# EasyEDA schematic SCH_PoC Sensor_Jao.json
TITLE: PoC Sensor; REV: 1.0; Date: 15/12/2023; Sheet: 1/1; Drawn By: Jao Dekeyser; Company: HoGent
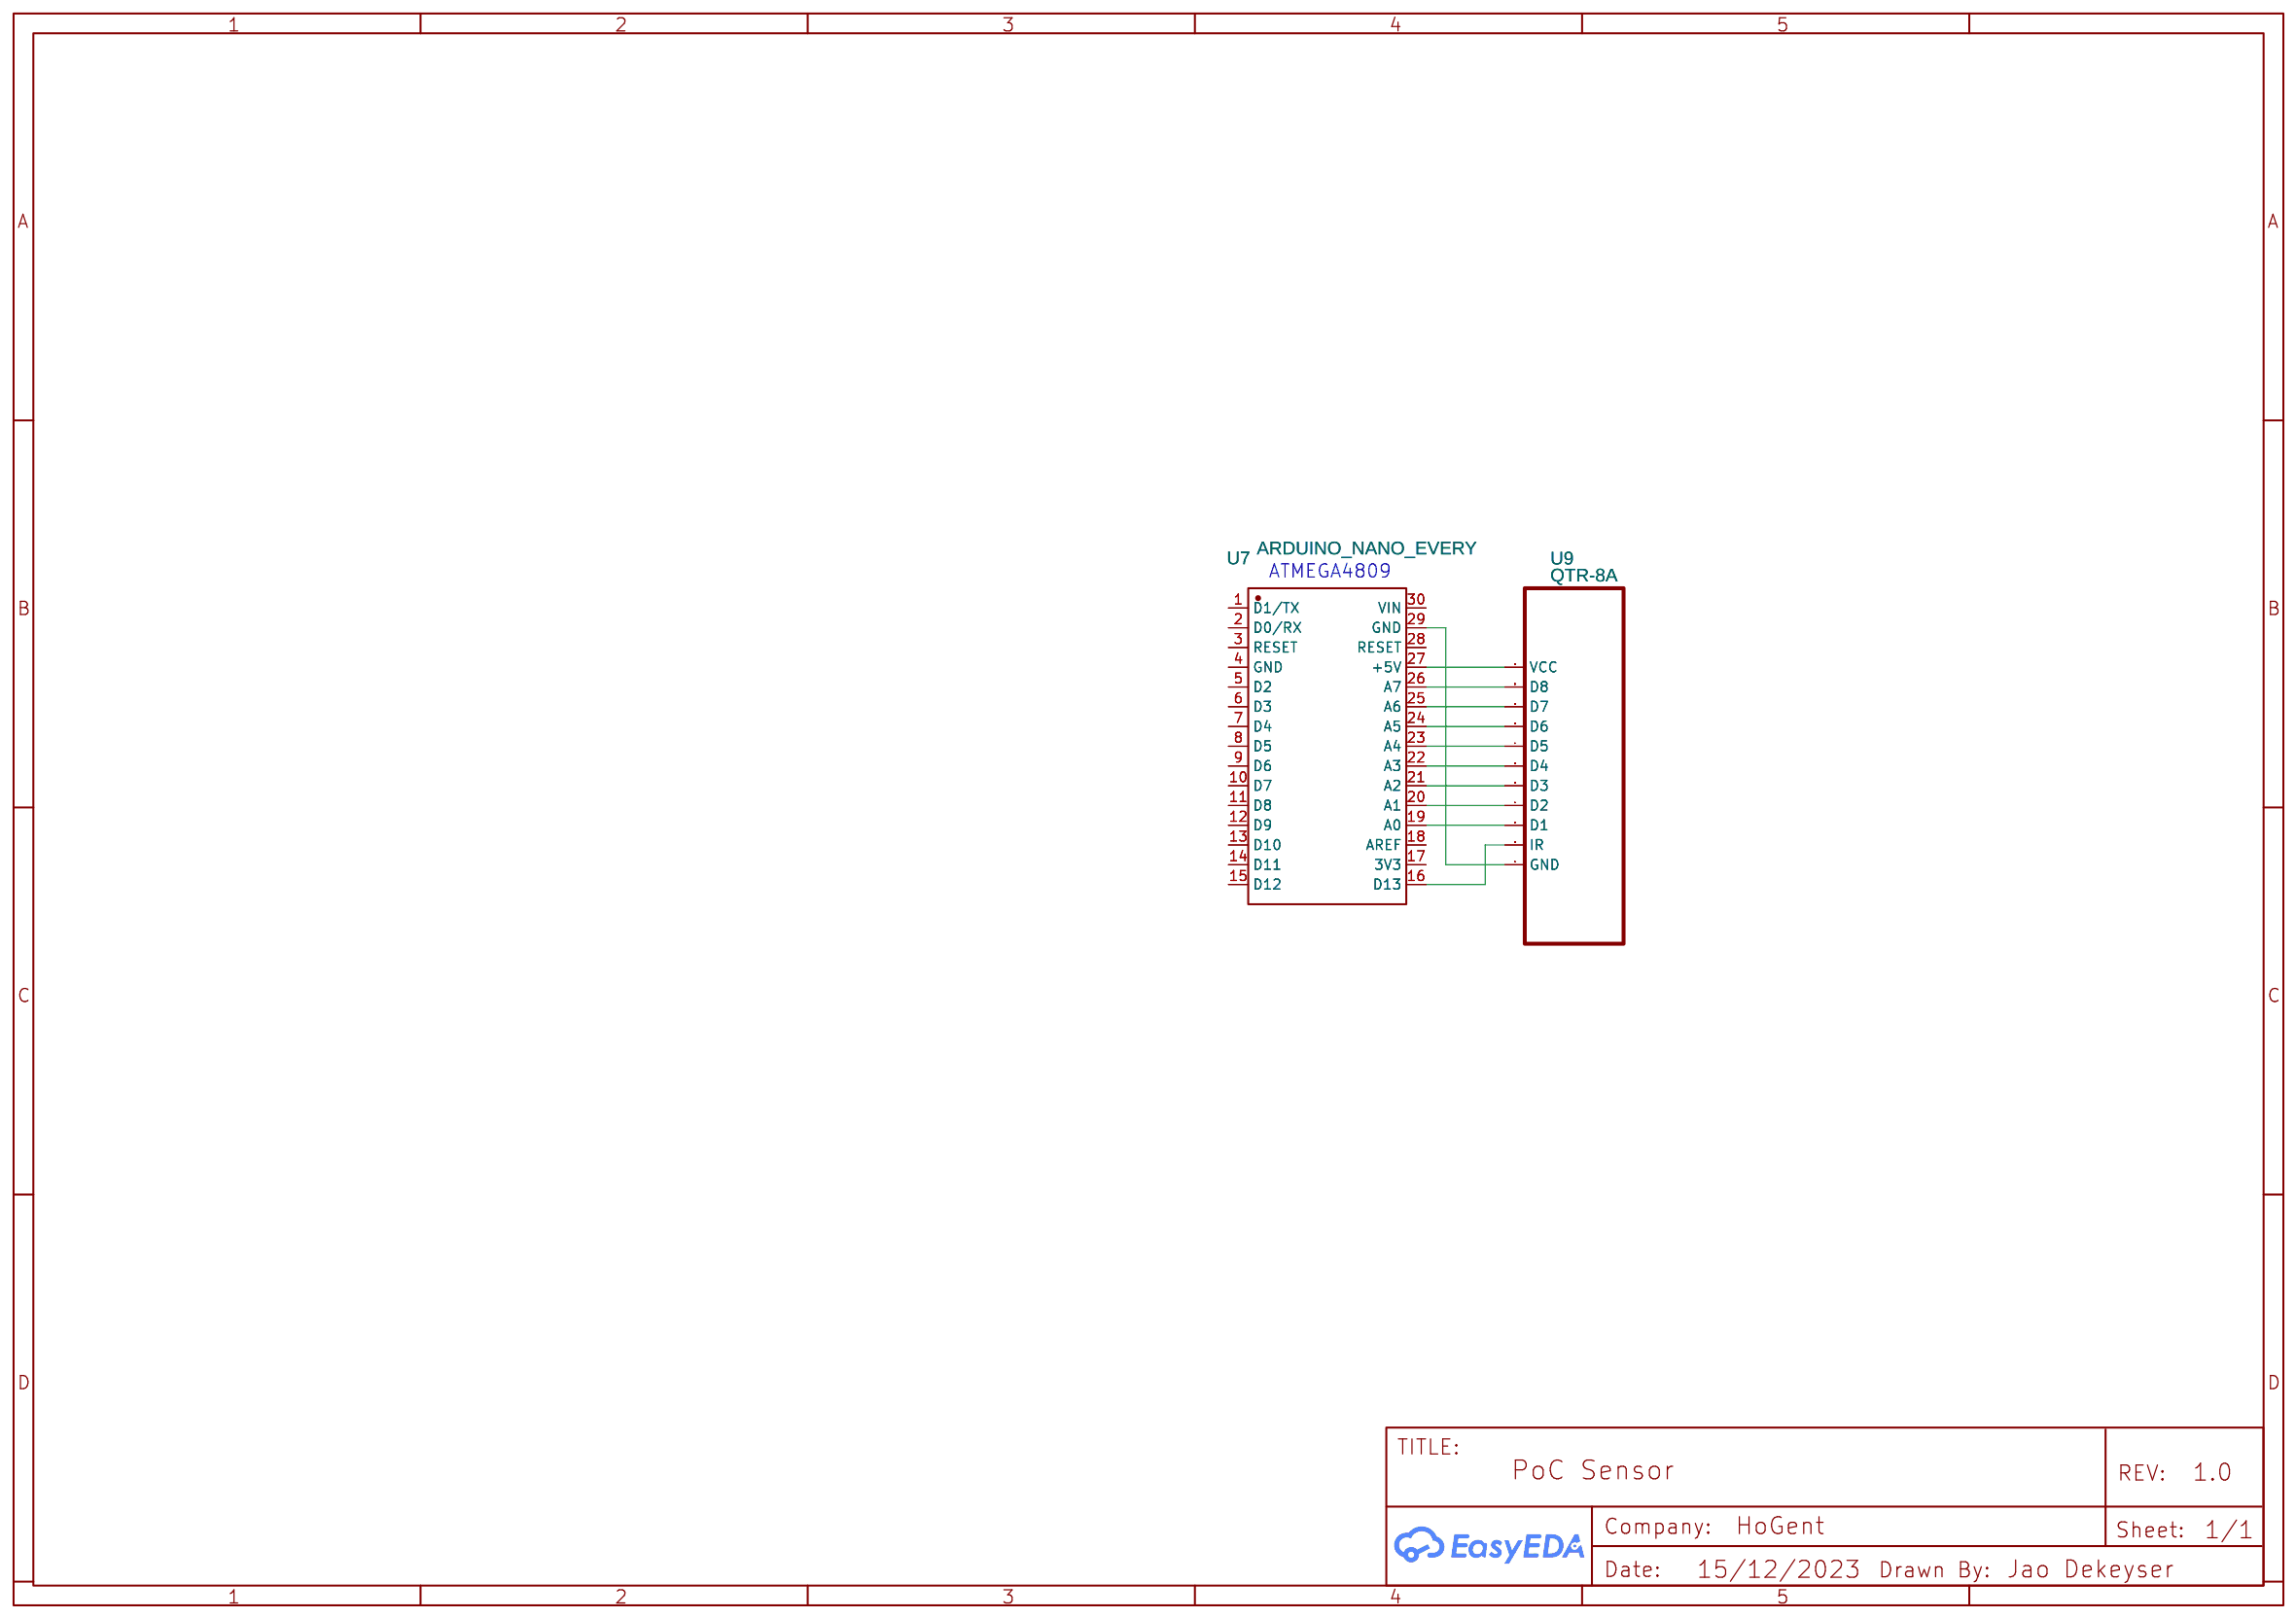
[diagram p0: schematic sheet]

## Parts
U7  ARDUINO_NANO_EVERY  [COMM-TH_ARDUINO_NANO]
U9  QTR-8A  [LINE SENSOR]

## Library data of the parts
U7 = ARDUINO_NANO: Contributor: lcsc; Supplier: LCSC; Supplier Part: C9900017879; Manufacturer: null; JLCPCB Part Class: Extended Part; link: https://lcsc.com/eda_search?q=C9900017879&%26type=1&ref=editor
U9 = QTR-8A: Contributor: giedresim

## Nets
Net-(U7-16): U7.16(D13) U9.2(IR)
Net-(U7-19): U7.19(A0) U9.3(D1)
Net-(U7-20): U7.20(A1) U9.4(D2)
Net-(U7-21): U7.21(A2) U9.5(D3)
Net-(U7-22): U7.22(A3) U9.6(D4)
Net-(U7-23): U7.23(A4) U9.7(D5)
Net-(U7-24): U7.24(A5) U9.8(D6)
Net-(U7-25): U7.25(A6) U9.9(D7)
Net-(U7-26): U7.26(A7) U9.10(D8)
Net-(U7-27): U7.27(+5V) U9.11(VCC)
Net-(U7-29): U7.29(GND) U9.1(GND)

Not connected (* = marked no-connect by the designer): U7 1(D1/TX) 2(D0/RX) 3(RESET) 4(GND) 5(D2) 6(D3) 7(D4) 8(D5) 9(D6) 10(D7) 11(D8) 12(D9) 13(D10) 14(D11) 15(D12) 17(3V3) 18(AREF) 28(RESET) 30(VIN)

## Notes on the sheet
- ATMEGA4809
